# Altium schematic sheet Connector.SchDoc
size A4; SheetNumber: 5; SheetTotal: 5
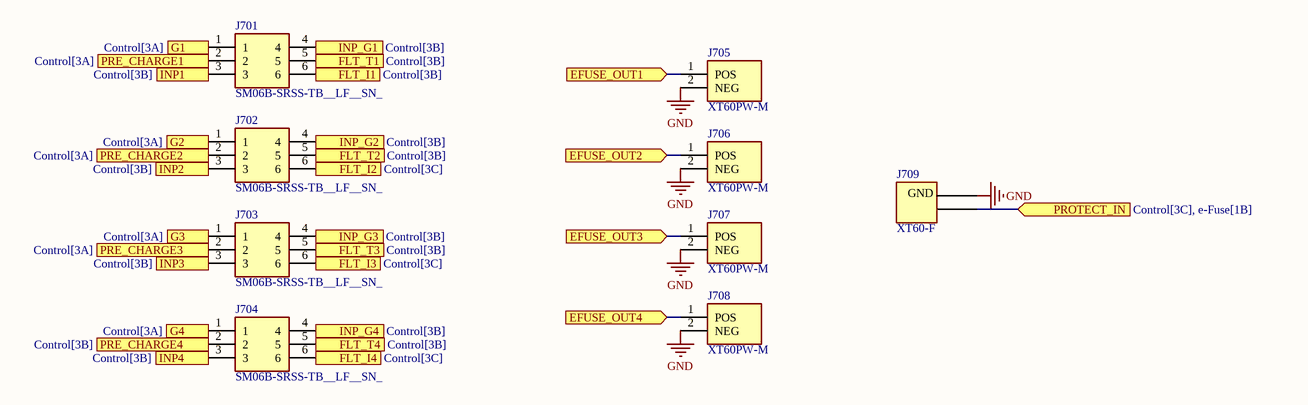
[diagram p0: Connector.SchDoc]

## Parts
J701  SM06B-SRSS-TB__LF__SN_  [SM06B-SRSS-TB]
J702  SM06B-SRSS-TB__LF__SN_  [SM06B-SRSS-TB]
J703  SM06B-SRSS-TB__LF__SN_  [SM06B-SRSS-TB]
J704  SM06B-SRSS-TB__LF__SN_  [SM06B-SRSS-TB]
J705  XT60PW-M  [XT60PW-M]
J706  XT60PW-M  [XT60PW-M]
J707  XT60PW-M  [XT60PW-M]
J708  XT60PW-M  [XT60PW-M]
J709  XT60-F  [XT60_F]

## Ports
EFUSE_OUT1 (in, see Control[3C]), EFUSE_OUT2 (in, see Control[3C]), EFUSE_OUT3 (in, see Control[3C]), EFUSE_OUT4 (in, see Control[3C]), FLT_I1 (out, see Control[3B]), FLT_I2 (out, see Control[3C]), FLT_I3 (out, see Control[3C]), FLT_I4 (out, see Control[3C]), FLT_T1 (out, see Control[3B]), FLT_T2 (out, see Control[3B]), FLT_T3 (out, see Control[3B]), FLT_T4 (out, see Control[3B]), G1 (in, see Control[3A]), G2 (in, see Control[3A]), G3 (in, see Control[3A]), G4 (in, see Control[3A]), INP1 (in, see Control[3B]), INP2 (in, see Control[3B]), INP3 (in, see Control[3B]), INP4 (in, see Control[3B]), INP_G1 (in, see Control[3B]), INP_G2 (in, see Control[3B]), INP_G3 (in, see Control[3B]), INP_G4 (in, see Control[3B]), PRE_CHARGE1 (in, see Control[3A]), PRE_CHARGE2 (in, see Control[3A]), PRE_CHARGE3 (in, see Control[3A]), PRE_CHARGE4 (in, see Control[3B]), PROTECT_IN (in, see Control[3C], e-Fuse[1B])

## Nets
GND: J705.2(NEG) J706.2(NEG) J707.2(NEG) J708.2(NEG) J709.1
EFUSE_OUT1: J705.1(POS) ; port EFUSE_OUT1
EFUSE_OUT2: J706.1(POS) ; port EFUSE_OUT2
EFUSE_OUT3: J707.1(POS) ; port EFUSE_OUT3
EFUSE_OUT4: J708.1(POS) ; port EFUSE_OUT4
FLT_I1: J701.6 ; port FLT_I1
FLT_I2: J702.6 ; port FLT_I2
FLT_I3: J703.6 ; port FLT_I3
FLT_I4: J704.6 ; port FLT_I4
FLT_T1: J701.5 ; port FLT_T1
FLT_T2: J702.5 ; port FLT_T2
FLT_T3: J703.5 ; port FLT_T3
FLT_T4: J704.5 ; port FLT_T4
G1: J701.1 ; port G1
G2: J702.1 ; port G2
G3: J703.1 ; port G3
G4: J704.1 ; port G4
INP1: J701.3 ; port INP1
INP2: J702.3 ; port INP2
INP3: J703.3 ; port INP3
INP4: J704.3 ; port INP4
INP_G1: J701.4 ; port INP_G1
INP_G2: J702.4 ; port INP_G2
INP_G3: J703.4 ; port INP_G3
INP_G4: J704.4 ; port INP_G4
PRE_CHARGE1: J701.2 ; port PRE_CHARGE1
PRE_CHARGE2: J702.2 ; port PRE_CHARGE2
PRE_CHARGE3: J703.2 ; port PRE_CHARGE3
PRE_CHARGE4: J704.2 ; port PRE_CHARGE4
PROTECT_IN: J709.2 ; port PROTECT_IN

## Notes on the sheet
- (in symbol CMP-019-000061-2) GND

## Library data of the parts
J701-J704 = SM06B-SRSS-TB__LF__SN_: Connector; Manufacturer_Name: JST (JAPAN SOLDERLESS TERMINALS); Manufacturer_Part_Number: SM06B-SRSS-TB (LF)(SN); Datasheet Link: http://uk.rs-online.com/web/p/products/5468827
J705-J708 = CMP-019-000059-3: Socket, DC supply, male, PIN: 2; MF: AMASS; System: Connector; Package: Package; SnapEDA_Link: https://www.snapeda.com/parts/XT60PW-M/AMASS/view-part/?ref=snap; Design Item ID: XT60PW-M; Check_prices: https://www.snapeda.com/parts/XT60PW-M/AMASS/view-part/?ref=eda; MP: XT60PW-M; Price: None; Availability: Not in stock; Source: robit_connector.SchLib; Value: *
J709 = CMP-019-000061-2: XT60 connector; System: Connector